# Altium schematic sheet DS3231.SchDoc
size A4
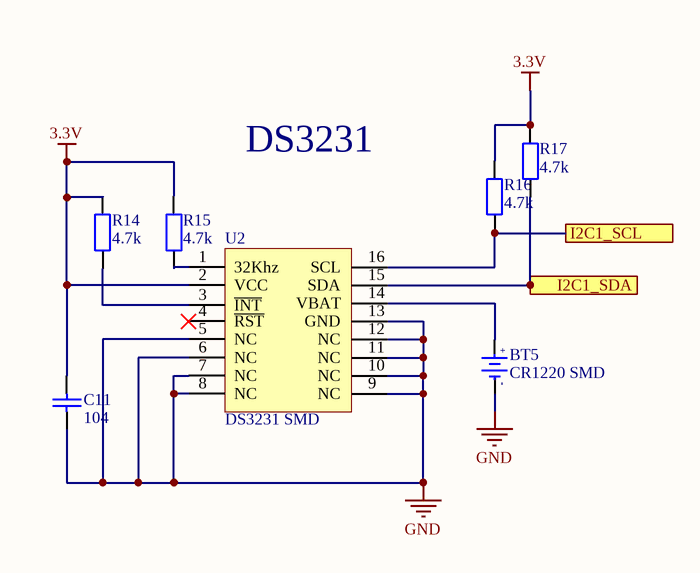
[diagram p0: DS3231.SchDoc]

## Parts
BT5  CR1220 SMD  [DE PIN CR1220]
C11  104  [tu 1206]
R14  4.7k  [tro smd 0805]
R15  4.7k  [tro smd 0805]
R16  4.7k  [tro smd 0805]
R17  4.7k  [tro smd 0805]
U2  DS3231 SMD  [SOIC 16]

## Ports
I2C1_SCL, I2C1_SDA

## Nets
3.3V: C11.1 R14.2 R15.2 R16.2 R17.2 U2.2(VCC)
GND: BT5.2(GND) C11.2 U2.5(NC) U2.6(NC) U2.7(NC) U2.8(NC) U2.9(NC) U2.10(NC) U2.11(NC) U2.12(NC) U2.13(GND)
I2C1_SCL: R16.1 U2.16(SCL) ; port I2C1_SCL
I2C1_SDA: R17.1 U2.15(SDA) ; port I2C1_SDA
NetBT5_1: BT5.1(+3V) U2.14(VBAT)
NetR14_1: R14.1 U2.3(~{INT})
NetR15_1: R15.1 U2.1(32Khz)

Not connected (* = marked no-connect by the designer): U2 4(~{RST})*

## Notes on the sheet
- DS3231
- (in symbol De pin CR1220 SMD) +; -

## Library data of the parts
BT5 = De pin CR1220 SMD: Ten: Đế PIN CR1220 SMD; Ma_Hang: MH000833
C11 = Tu 1206 104 50V 20%: Dán; Don_Vi: Con; So_Chan: 2; Ten_Linh_Kien: Tụ 1206 104-0.1uF 20% 50V; Ma_Hang: MH004544; Chung_Loai: Dán; Kieu_Chan: *
R14-R17 = Tro 0805 5% 4.7k: Dán; Don_Vi: Con; So_Chan: 2; Ten_Linh_Kien: Trở 0805 5% 4.7k; Ma_Hang: MH005307; Chung_Loai: Dán; Kieu_Chan: *
U2 = DS3231 SMD: SOIC